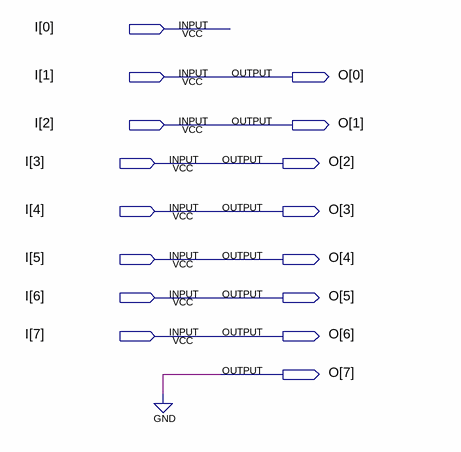
[diagram p0: schematic sheet]
// Quartus schematic SHIFT_RIGHT_1.bdf as structural Verilog: 0 symbols, 16 pins
module SHIFT_RIGHT_1 (
  input  [7:0] I,
  output [7:0] O
);


  assign O = {1'b0, I[7:1]};
endmodule
